# EAGLE design baseboard (EAGLE 7.3.0)
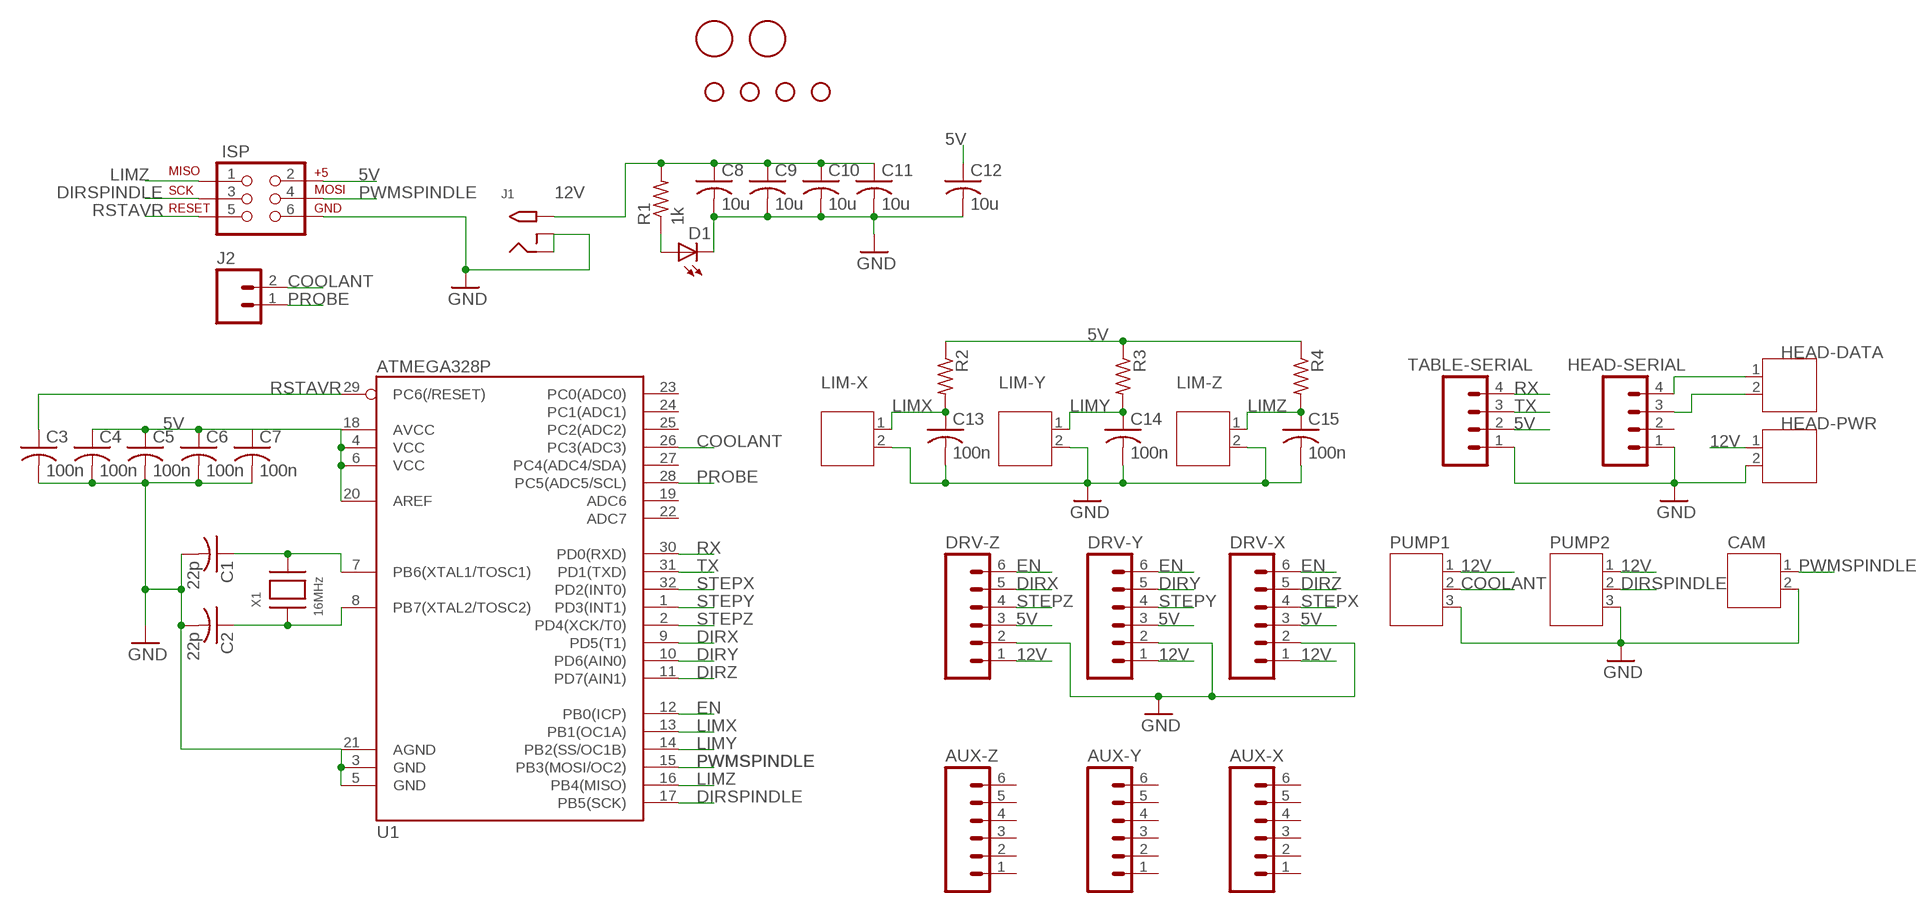
[diagram p0: schematic, sheet 1]

## Parts
AUX-X  M06LOCK  [1X06_LOCK]
AUX-Y  M06LOCK  [1X06_LOCK]
AUX-Z  M06LOCK  [1X06_LOCK]
C1  22p  C-USC0603  [C0603]
C2  22p  C-USC0603  [C0603]
C3  100n  C-USC0603  [C0603]
C4  100n  C-USC0603  [C0603]
C5  100n  C-USC0603  [C0603]
C6  100n  C-USC0603  [C0603]
C7  100n  C-USC0603  [C0603]
C8  10u  C-USC1206  [C1206]
C9  10u  C-USC1206  [C1206]
C10  10u  C-USC1206  [C1206]
C11  10u  C-USC1206  [C1206]
C12  10u  C-USC1206  [C1206]
C13  100n  C-USC0603  [C0603]
C14  100n  C-USC0603  [C0603]
C15  100n  C-USC0603  [C0603]
CAM  JST-PH2  [JST-PH2]
D1  LEDCHIPLED_1206  [CHIPLED_1206]
DRV-X  M06LOCK  [1X06_LOCK]
DRV-Y  M06LOCK  [1X06_LOCK]
DRV-Z  M06LOCK  [1X06_LOCK]
HEAD-DATA  JST-PH2  [JST-PH2]
HEAD-PWR  JST-PH2  [JST-PH2]
HEAD-SERIAL  M04LOCK  [1X04_LOCK]
ISP  AVR_SPI_PRG_6PTH  [2X3]
J1  2.1MMJACKTHM  [PJ-102A]
J2  M02PTH  [1X02]
LIM-X  JST-PH2  [JST-PH2]
LIM-Y  JST-PH2  [JST-PH2]
LIM-Z  JST-PH2  [JST-PH2]
PUMP1  JST-PH3  [JST-PH3]
PUMP2  JST-PH3  [JST-PH3]
R1  1k  R-US_R1206  [R1206]
R2  R-US_R0603  [R0603]
R3  R-US_R0603  [R0603]
R4  R-US_R0603  [R0603]
STANDOFF1  STAND-OFFTIGHT  [STAND-OFF-TIGHT]
STANDOFF2  STAND-OFFTIGHT  [STAND-OFF-TIGHT]
STANDOFF3  STAND-OFFTIGHT  [STAND-OFF-TIGHT]
STANDOFF4  STAND-OFFTIGHT  [STAND-OFF-TIGHT]
TABLE-SERIAL  M04LOCK  [1X04_LOCK]
U1  ATMEGA328P  ATMEGA328_SMT  [TQFP32-08]
U$1  FIDUCIAL  [FIDUCIAL_1MM]
U$2  FIDUCIAL  [FIDUCIAL_1MM]
X1  16MHz  XTAL-3.2X1.5  [XTAL3215]

## Nets
5V: C4.1 C5.1 C6.1 C7.1 C12.1 DRV-X.3 DRV-Y.3 DRV-Z.3 ISP.2 R2.1 R3.1 R4.1 TABLE-SERIAL.2 U1.4(VCC) U1.6(VCC) U1.18(AVCC) U1.20(AREF)
12V: C8.1 C9.1 C10.1 C11.1 DRV-X.1 DRV-Y.1 DRV-Z.1 HEAD-PWR.1 J1.TIP PUMP1.1 PUMP2.1 R1.2
COOLANT: J2.2 PUMP1.2 U1.26(PC3(ADC3))
DIRSPINDLE: ISP.3 PUMP2.2 U1.17(PB5(SCK))
DIRX: DRV-Z.5 U1.9(PD5(T1))
DIRY: DRV-Y.5 U1.10(PD6(AIN0))
DIRZ: DRV-X.5 U1.11(PD7(AIN1))
EN: DRV-X.6 DRV-Y.6 DRV-Z.6 U1.12(PB0(ICP))
GND: C1.2 C2.2 C3.2 C4.2 C5.2 C6.2 C7.2 C8.2 C9.2 C10.2 C11.2 C12.2 C13.2 C14.2 C15.2 CAM.2 D1.C DRV-X.2 DRV-Y.2 DRV-Z.2 HEAD-PWR.2 HEAD-SERIAL.1 ISP.6 J1.RING J1.RING_SW LIM-X.2 LIM-Y.2 LIM-Z.2 PUMP1.3 PUMP2.3 TABLE-SERIAL.1 U1.3(GND) U1.5(GND) U1.21(AGND)
LIMX: C13.1 LIM-X.1 R2.2 U1.13(PB1(OC1A))
LIMY: C14.1 LIM-Y.1 R3.2 U1.14(PB2(SS/OC1B))
LIMZ: C15.1 ISP.1 LIM-Z.1 R4.2 U1.16(PB4(MISO))
N$1: C1.1 U1.7(PB6(XTAL1/TOSC1)) X1.P$2
N$2: C2.1 U1.8(PB7(XTAL2/TOSC2)) X1.P$1
N$3: D1.A R1.1
N$6: HEAD-DATA.1 HEAD-SERIAL.4
N$7: HEAD-DATA.2 HEAD-SERIAL.3
PROBE: J2.1 U1.28(PC5(ADC5/SCL))
PWMSPINDLE: CAM.1 ISP.4 U1.15(PB3(MOSI/OC2))
RSTAVR: C3.1 ISP.5 U1.29(PC6(/RESET))
RX: TABLE-SERIAL.4 U1.30(PD0(RXD))
STEPX: DRV-X.4 U1.32(PD2(INT0))
STEPY: DRV-Y.4 U1.1(PD3(INT1))
STEPZ: DRV-Z.4 U1.2(PD4(XCK/T0))
TX: TABLE-SERIAL.3 U1.31(PD1(TXD))
Unconnected: AUX-X.1 AUX-X.2 AUX-X.3 AUX-X.4 AUX-X.5 AUX-X.6 AUX-Y.1 AUX-Y.2 AUX-Y.3 AUX-Y.4 AUX-Y.5 AUX-Y.6 AUX-Z.1 AUX-Z.2 AUX-Z.3 AUX-Z.4 AUX-Z.5 AUX-Z.6 HEAD-SERIAL.2 U1.19(ADC6) U1.22(ADC7) U1.23(PC0(ADC0)) U1.24(PC1(ADC1)) U1.25(PC2(ADC2)) U1.27(PC4(ADC4/SDA))

## Library data of the parts
AUX-X AUX-Y AUX-Z DRV-X DRV-Y DRV-Z = SparkFun-Connectors:M06: Header 6 Standard 6-pin 0.1" header. Use with straight break away headers (SKU : PRT-00116), right angle break away headers (PRT-00553), swiss pins (PRT-00743), machine pins (PRT-00117), and female headers (PRT-00115). Molex polarized connector foot print use with SKU : PRT-08094 with associated crimp pins and housings. NOTES ON THE VARIANTS LOCK and LOCK_LONGPADS... This footprint was designed to help hold the alignment of a through-hole component (i.e. 6-pin header) while soldering it into place. You may notice that each hole has been shifted either up or down by 0.005 of an inch from it's more standard position (which is a perfectly straight line). This slight alteration caused the pins (the squares in the middle) to touch the edges of the holes. Because they are alternating, it causes a "brace" to hold the component in place. 0.005 has proven to be the perfect amount of "off-center" position when using our standard breakaway headers. Although looks a little odd when you look at the bare footprint, once you have a header in there, the alteration is very hard to notice. Also,if you push a header all the way into place, it is covered up entirely on the bottom side. This idea of altering the position of holes to aid alignment will be further integrated into the Sparkfun Library for other footprints. It can help hold any component with 3 or more connection pins.
C1-C15 = adafruit:C-US: CAPACITOR, American symbol
CAM HEAD-DATA HEAD-PWR LIM-X LIM-Y LIM-Z = jst-ph:JST-PH2
D1 = adafruit:LED: LED OSRAM: - CHIPLED LG R971, LG N971, LY N971, LG Q971, LY Q971, LO R971, LY R971 LH N974, LH R974 LS Q976, LO Q976, LY Q976 LO Q996 - Hyper CHIPLED LW Q18S LB Q993, LB Q99A, LB R99A - SideLED LS A670, LO A670, LY A670, LG A670, LP A670 LB A673, LV A673, LT A673, LW A673 LH A674 LY A675 LS A676, LA A676, LO A676, LY A676, LW A676 LS A679, LY A679, LG A679 - Hyper Micro SIDELED® LS Y876, LA Y876, LO Y876, LY Y876 LT Y87S - SmartLED LW L88C, LW L88S LB L89C, LB L89S, LG L890 LS L89K, LO L89K, LY L89K LS L896, LA L896, LO L896, LY L896 - TOPLED LS T670, LO T670, LY T670, LG T670, LP T670 LSG T670, LSP T670, LSY T670, LOP T670, LYG T670 LG T671, LOG T671, LSG T671 LB T673, LV T673, LT T673, LW T673 LH T674 LS T676, LA T676, LO T676, LY T676, LB T676, LH T676, LSB T676, LW T676 LB T67C, LV T67C, LT T67C, LS T67K, LO T67K, LY T67K, LW E67C LS E67B, LA E67B, LO E67B, LY E67B, LB E67C, LV E67C, LT E67C LW T67C LS T679, LY T679, LG T679 LS T770, LO T770, LY T770, LG T770, LP T770 LB T773, LV T773, LT T773, LW T773 LH T774 LS E675, LA E675, LY E675, LS T675 LS T776, LA T776, LO T776, LY T776, LB T776 LHGB T686 LT T68C, LB T68C - Hyper Mini TOPLED® LB M676 - Mini TOPLED Santana® LG M470 LS M47K, LO M47K, LY M47K Source: http://www.osram.convergy.de/
HEAD-SERIAL TABLE-SERIAL = SparkFun-Connectors:M04: Header 4 Standard 4-pin 0.1" header. Use with straight break away headers (SKU : PRT-00116), right angle break away headers (PRT-00553), swiss pins (PRT-00743), machine pins (PRT-00117), and female headers (PRT-00115). Molex polarized connector foot print use with SKU : PRT-08231 with associated crimp pins and housings. 1MM SMD Version SKU: PRT-10208
ISP = SparkFun-Connectors:AVR_SPI_PRG_6: AVR ISP 6 Pin This is the reduced ISP connector for AVR programming. Common on Arduino. This footprint will take up less PCB space and can be used with a 10-pin to 6-pin adapter such as SKU: BOB-08508 **Special note about "TEST_POINT" package. The stop mask is on the top side, so if you want your programming test points to be on the bottom of your board, make sure to place this package on the bottom side of the board. This also ensure that the orientation to program from the bottom side will be correct.
J1 = adafruit:2.1MMJACK: 2.1mm x 5.5mm THM DC jack with internal switch. Digikey part #PJ-102A, 4UCON part #05537 2.1mm x 5.5mm SMT DC jack with internal switch. Digikey part #PJ-002A-SMT, 4UCON part #03267 By microbuilder.eu & adafruit.com
J2 = SparkFun-Connectors:M02: Standard 2-pin 0.1" header. Use with - straight break away headers ( PRT-00116) - right angle break away headers (PRT-00553) - swiss pins (PRT-00743) - machine pins (PRT-00117) - female headers (PRT-00115) Molex polarized connector foot print use with: PRT-08233 with associated crimp pins and housings. 2.54_SCREWTERM for use with PRT-10571. 3.5mm Screw Terminal footprints for PRT-08084 5mm Screw Terminal footprints for use with PRT-08432
PUMP1 PUMP2 = jst-ph:JST-PH3
R1-R4 = adafruit:R-US_: RESISTOR, American symbol
STANDOFF1-STANDOFF4 = SparkFun-Electromechanical:STAND-OFF: #4 Stand Off This is the mechanical footprint for a #4 phillips button head screw. Use the keepout ring to avoid running the screw head into surrounding components. SKU : PRT-00447
U1 = SparkFun-DigitalIC:ATMEGA328_SMT: 32-Pin Atmega328 part Commonly used on Arduino compatible boards Available in QFP and QFN packages TQFP is IC-09069 QFN is non-stock; PROD_ID: IC-09069
U$1 U$2 = adafruit:FIDUCIAL: For use by pick and place machines to calibrate the vision/machine, 1mm By microbuilder.eu
X1 = adafruit:XTAL: Low cost SMT crystals, no capacitors included http://www.ladyada.net/library/eagle

## Board
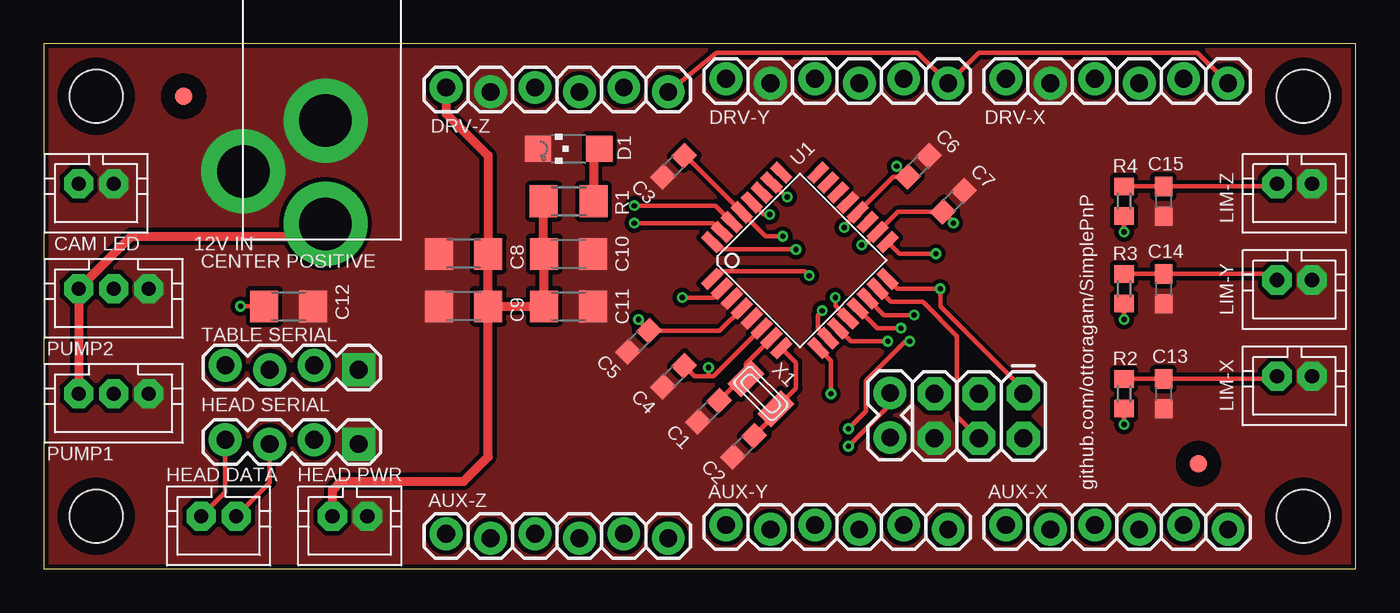
[diagram p1: board, top side]
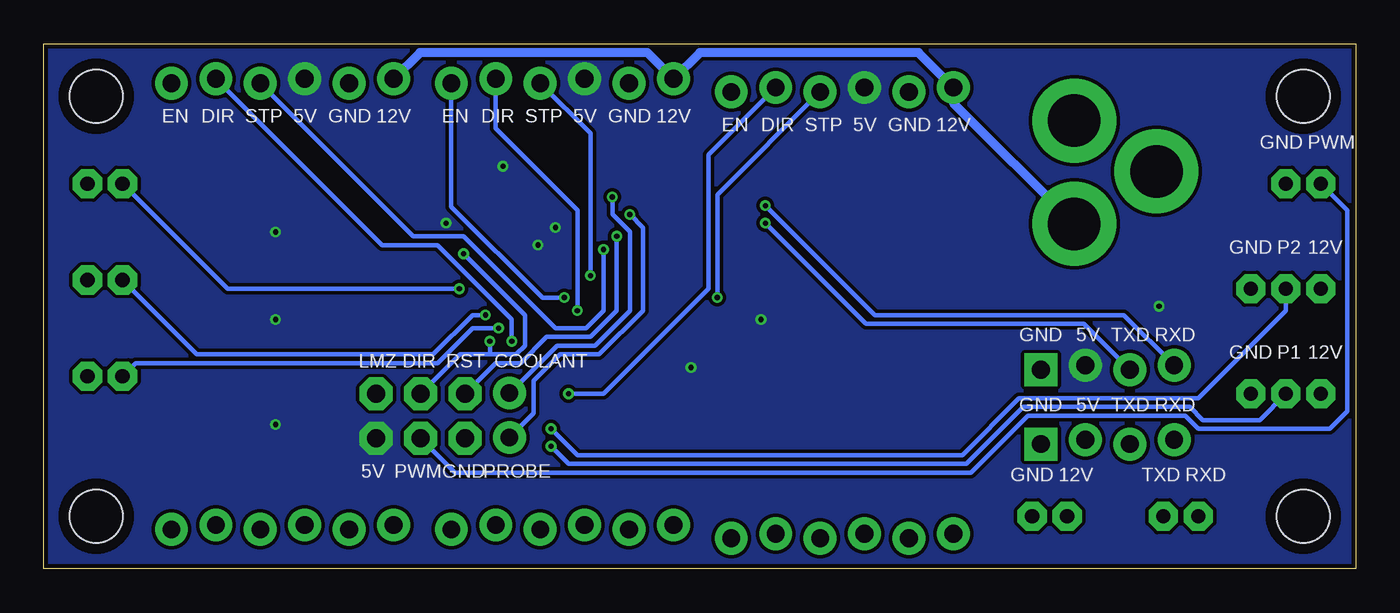
[diagram p2: board, bottom side, seen from below]

Size 75 x 30 mm. Coordinates in mm from the lower left corner, seen from the top.
Outline: 0,0 75,0 75,30 0,30 0,0
Copper layers (1*16): Top 0.035mm / dielectric 1.5mm / Bottom 0.035mm
Design rules "default": minimum track width 6mil, minimum drill 0.3mm, track to track 6mil, track to pad 6mil, pad to pad 6mil, via to via 6mil, smd to smd 0mil, copper to edge 0.25mm, drill to drill 0.25mm, minimum pad ring 10mil, minimum via ring 6mil, stop-mask expansion 2mil, vias tented up to drill 100mil, thermal gap 10mil

### Footprints (pad centres in the part's own frame; a part is rotated, then mirrored left to right if it is on the bottom)
1X06_LOCK = drill 1.016 pad 1.88: 1 0,0; 2 2.54,-0.254; 3 5.08,0; 4 7.62,-0.254; 5 10.16,0; 6 12.7,-0.254
C0603 = smd 1.1 x 1: 1 -0.85,0; 2 0.85,0
C1206 = smd 1.6 x 1.8: 1 -1.4,0; 2 1.4,0
JST-PH2 = drill 0.813 pad 1.676 octagon: 1 1,0; 2 -1,0
CHIPLED_1206 = smd 1.5 x 1.5: A 0,-1.75; C 0,1.75
1X04_LOCK = drill 1.016 pad 1.88 square: 1 0,0.127 | drill 1.016 pad 1.88: 2 2.54,-0.127; 3 5.08,0.127; 4 7.62,-0.127
2X3 = drill 1.016 pad 1.88 octagon: 1 0,0; 2 0,2.54; 3 2.54,0; 4 2.54,2.54; 5 5.08,0; 6 5.08,2.54
PJ-102A = drill 3 pad 4.8: RING 0.1,-3.39; RING_SW -4.6,-6.29; TIP 0.1,-9.29
1X02 = drill 1.016 pad 1.88: 1 0,0; 2 2.54,0
JST-PH3 = drill 0.813 pad 1.676 octagon: 1 2,0; 2 0,0; 3 -2,0
R1206 = smd 1.6 x 1.803: 1 -1.422,0; 2 1.422,0
R0603 = smd 1 x 1.1: 1 -0.85,0; 2 0.85,0
STAND-OFF-TIGHT = hole 3.048: 0,0
TQFP32-08 = smd 1.27 x 0.559: 1 -4.293,2.8; 2 -4.293,2; 3 -4.293,1.2; 4 -4.293,0.4; 5 -4.293,-0.4; 6 -4.293,-1.2; 7 -4.293,-2; 8 -4.293,-2.8; 17 4.293,-2.8; 18 4.293,-2; 19 4.293,-1.2; 20 4.293,-0.4; 21 4.293,0.4; 22 4.293,1.2; 23 4.293,2; 24 4.293,2.8 | smd 0.559 x 1.27: 9 -2.8,-4.293; 10 -2,-4.293; 11 -1.2,-4.293; 12 -0.4,-4.293; 13 0.4,-4.293; 14 1.2,-4.293; 15 2,-4.293; 16 2.8,-4.293; 25 2.8,4.293; 26 2,4.293; 27 1.2,4.293; 28 0.4,4.293; 29 -0.4,4.293; 30 -1.2,4.293; 31 -2,4.293; 32 -2.8,4.293
FIDUCIAL_1MM = smd 1 x 1: 1 0,0
XTAL3215 = smd 1.1 x 1.9: P$1 1.2,0; P$2 -1.2,0

### Placement (x,y rotation side)
AUX-X  55,2.5 0 top
AUX-Y  39,2.5 0 top
AUX-Z  23,2 0 top
C1  38,9 225 top
C2  40,7 225 top
C3  36,23 225 top
C4  36,11 225 top
C5  34,13 225 top
C6  50,23 45 top
C7  52,21 45 top
C8  24,18 180 top
C9  24,15 180 top
C10  30,18 0 top
C11  30,15 0 top
C12  14,15 0 top
C13  64,10 270 top
C14  64,16 270 top
C15  64,21 270 top
CAM  3,22 180 top
D1  30,24 90 top
DRV-X  55,28 0 top
DRV-Y  39,28 0 top
DRV-Z  23,27.5 0 top
HEAD-DATA  10,3 180 top
HEAD-PWR  17.5,3 180 top
HEAD-SERIAL  18,7.25 180 top
ISP  56,10 180 top
J1  16,29 0 top
J2  48.38,7.5 90 top
LIM-X  71.5,11 180 top
LIM-Y  71.5,16.5 180 top
LIM-Z  71.5,22 180 top
PUMP1  4,10 180 top
PUMP2  4,16 180 top
R1  30,21 180 top
R2  61.75,10 90 top
R3  61.75,16 90 top
R4  61.75,21 90 top
STANDOFF1  3,3 0 top
STANDOFF2  72,3 0 top
STANDOFF3  3,27 0 top
STANDOFF4  72,27 0 top
TABLE-SERIAL  18,11.5 180 top
U1  43.22,17.62 45 top
U$1  66,6 0 top
U$2  8,27 0 top
X1  41,10 315 top

### Tracks (layer width: path | path; a pad name or v marks a point on that pad's centre or on a via)
5V  (via drill 0.3, 0.3 pad 0.6)
  Top 0.25: U1.4 38.63,13.6 C5.1 34,14.2 v34,14.25 | U1.6 38.3,11 38,11 | 38,11 37.2,11 C4.1 | v38,11.5 38,11 | v48.75,23 49.35,22.4 C6.1 48.56,22.4 U1.20 45.75,19.58 v45.75,19.5 | v52,19.75 52,19.8 C7.1 48.83,20.4 U1.18 46.93,18.5 v46.75,18.5 | R4.1 v61.75,19.25 | R3.1 v61.75,14.25 | R2.1 v61.75,8.25 | C12.1 v11.25,15
  pour Bottom (isolate 0.2, rank 6, no thermals): 0,0 75,0 75,30 0,30
12V
  Top 0.5: C9.1 C11.1 C10.1 28.58,18.02 R1.2 | C9.1 C8.1 | C8.1 25.42,18.02 | DRV-Z.1 23,26 25.4,23.6 C8.1 | HEAD-PWR.1 16.5,4.5 17,5 24,5 25.4,6.4 C9.1 | PUMP1.1 PUMP2.1 5,19 15.39,19 J1.TIP
  Bottom 0.5: DRV-X.1 53.5,29.5 40.5,29.5 DRV-Y.1 37.5,29.5 25,29.5 DRV-Z.1 23,26.61 J1.TIP
COOLANT  (via drill 0.3, 0.3 pad 0.6)
  Top 0.25: v42.5,21.25 42.42,21.25 U1.26 | v46,7 48.38,9.38 J2.2
  Bottom 0.25: J2.2 45.67,12.75 43.5,12.75 41.5,14.75 41.5,19.25 42.5,20.25 v42.5,21.25 | PUMP1.2 5.5,8.5 8.75,8.5 9.5,9.25 19,9.25 22.25,6 45,6 v46,7
DIRSPINDLE  (via drill 0.3, 0.3 pad 0.6)
  Top 0.25: 48.33,18.68 U1.17 48.91,18 v51,18 | v46,8 47,9 47,10.75 49.25,13 v49.5,13
  Bottom 0.25: v51,18 47.5,14.5 47.5,12.75 48,12.25 49.5,12.25 | ISP.3 51.21,12.25 49.5,12.25 | PUMP2.2 4,14.75 9,9.75 19.25,9.75 22.5,6.5 44.5,6.5 v46,8 | v49.5,13 49.5,12.25
DIRX  (via drill 0.3 pad 0.6)
  Top 0.25: U1.9 45,11.88 v45,10
  Bottom 0.25: DRV-Z.5 37,23.66 37,16 43,10 v45,10
DIRY  (via drill 0.3 pad 0.6)
  Top 0.25: U1.10 44.25,13.75 44.25,14.5 v44.5,14.75
  Bottom 0.25: v44.5,14.75 44.5,20.5 49.16,25.16 DRV-Y.5
DIRZ  (via drill 0.3 pad 0.6)
  Top 0.25: U1.11 46.14,13 v48.25,13
  Bottom 0.25: v48.25,13 48.25,14.25 52.5,18.5 55.66,18.5 DRV-X.5
EN  (via drill 0.3 pad 0.6)
  Top 0.25: DRV-X.6 65.95,29.5 53.45,29.5 DRV-Y.6 49.95,29.5 38.45,29.5 DRV-Z.6 | U1.12 45.25,15.02 v45.25,15.5
  Bottom 0.25: DRV-Y.6 51.7,20.7 46.5,15.5 v45.25,15.5
GND
  pour Top (isolate 0.25, rank 6, no thermals): 0,0 75,0 75,30 0,30
LIMX  (via drill 0.3 pad 0.6)
  Top 0.25: U1.13 47.66,13.75 v49,13.75 | R2.2 C13.1 70.35,10.85 LIM-X.1
  Bottom 0.25: v49,13.75 50.5,13.75 52.5,11.75 69.75,11.75 LIM-X.1
LIMY  (via drill 0.3 pad 0.6)
  Top 0.25: U1.14 48.04,14.5 v49.75,14.5 | R3.2 C14.1 70.15,16.85 LIM-Y.1
  Bottom 0.25: LIM-Y.1 66.25,12.25 52.75,12.25 50.5,14.5 v49.75,14.5
LIMZ  (via drill 0.3 pad 0.6)
  Top 0.25: U1.16 48.8,16 v51.25,16 51.25,15 56,10.25 ISP.1 | R4.2 C15.1 70.35,21.85 LIM-Z.1
  Bottom 0.25: v51.25,16 64.5,16 LIM-Z.1
N$1
  Top 0.25: U1.7 40.15,11.72 X1.P$2 39.85,10.85 C1.1
N$2
  Top 0.25: C2.1 41.85,8.85 X1.P$1 43,10.3 43,11.77 U1.8
N$3
  Top 0.5: D1.A 31.42,23.67 R1.1
N$6
  Top 0.25: HEAD-DATA.1 10.38,4.38 HEAD-SERIAL.4
N$7
  Top 0.25: HEAD-DATA.2 12.92,4.92 HEAD-SERIAL.3
PROBE  (via drill 0.3 pad 0.6)
  Top 0.25: U1.28 41.16,20.25 v41.5,20.25
  Bottom 0.25: v41.5,20.25 40.75,19.5 40.75,14.75 43.25,12.25 45.5,12.25 47,10.75 47,8.88 J2.1
PWMSPINDLE
  Top 0.25: U1.15 48.42,15.25 50.25,15.25 52.2,13.3 52.2,8.72 ISP.4
  Bottom 0.25: CAM.1 0.5,20.5 0.5,9 1.5,8 9,8 9.75,8.75 18.75,8.75 22,5.5 51.5,5.5 ISP.4
RSTAVR  (via drill 0.3 pad 0.6)
  Top 0.25: v42.25,19 41.25,19 39.9,20.35 U1.29 36.67,23.6 C3.1
  Bottom 0.25: v42.25,19 42.25,14.75 43.75,13.25 46.25,13.25 47.75,11.75 49.17,11.75 ISP.5
RX  (via drill 0.3 pad 0.6)
  Top 0.25: v33.75,20.75 38.39,20.75 U1.30
  Bottom 0.25: v33.75,20.75 27.5,14.5 13.25,14.5 TABLE-SERIAL.4
STEPX  (via drill 0.3 pad 0.6)
  Top 0.25: U1.32 38.63,18.25 v43,18.25
  Bottom 0.25: DRV-X.4 53.87,19 51,19 45.75,13.75 44,13.75 43,14.75 v43,18.25
STEPY  (via drill 0.3 pad 0.6)
  Top 0.25: U1.1 38.64,17 43.5,17 v43.75,16.75
  Bottom 0.25: DRV-Y.4 43.75,24.88 v43.75,16.75
STEPZ  (via drill 0.3 pad 0.6)
  Top 0.25: v36.5,15.5 38.27,15.5 U1.2
  Bottom 0.25: DRV-Z.4 36.5,21.37 v36.5,15.5
TX  (via drill 0.3 pad 0.6)
  Top 0.25: v33.75,19.75 38.26,19.75 U1.31
  Bottom 0.25: v33.75,19.75 28,14 15.55,14 TABLE-SERIAL.3

### Text on the board
tNames: CAM LED | 12V IN | CENTER POSITIVE | PUMP2 | TABLE SERIAL | HEAD SERIAL | PUMP1 | HEAD DATA | HEAD PWR | github.com/ottoragam/SimplePnP
bNames: 12V | GND | 5V | STP | DIR | EN | 12V | GND | 5V | STP | DIR | EN | 12V | GND | 5V | STP | DIR | EN | PWM | GND | 12V | P2 | GND | RXD | TXD | 5V | GND | 12V | P1 | GND | COOLANT | RST | DIR | LMZ | RXD | TXD | 5V | GND | PROBE | GND | PWM | 5V | RXD | TXD | 12V | GND